# EAGLE design tick-box-1591b-shield-mk-1.0 (EAGLE 6.5.0)
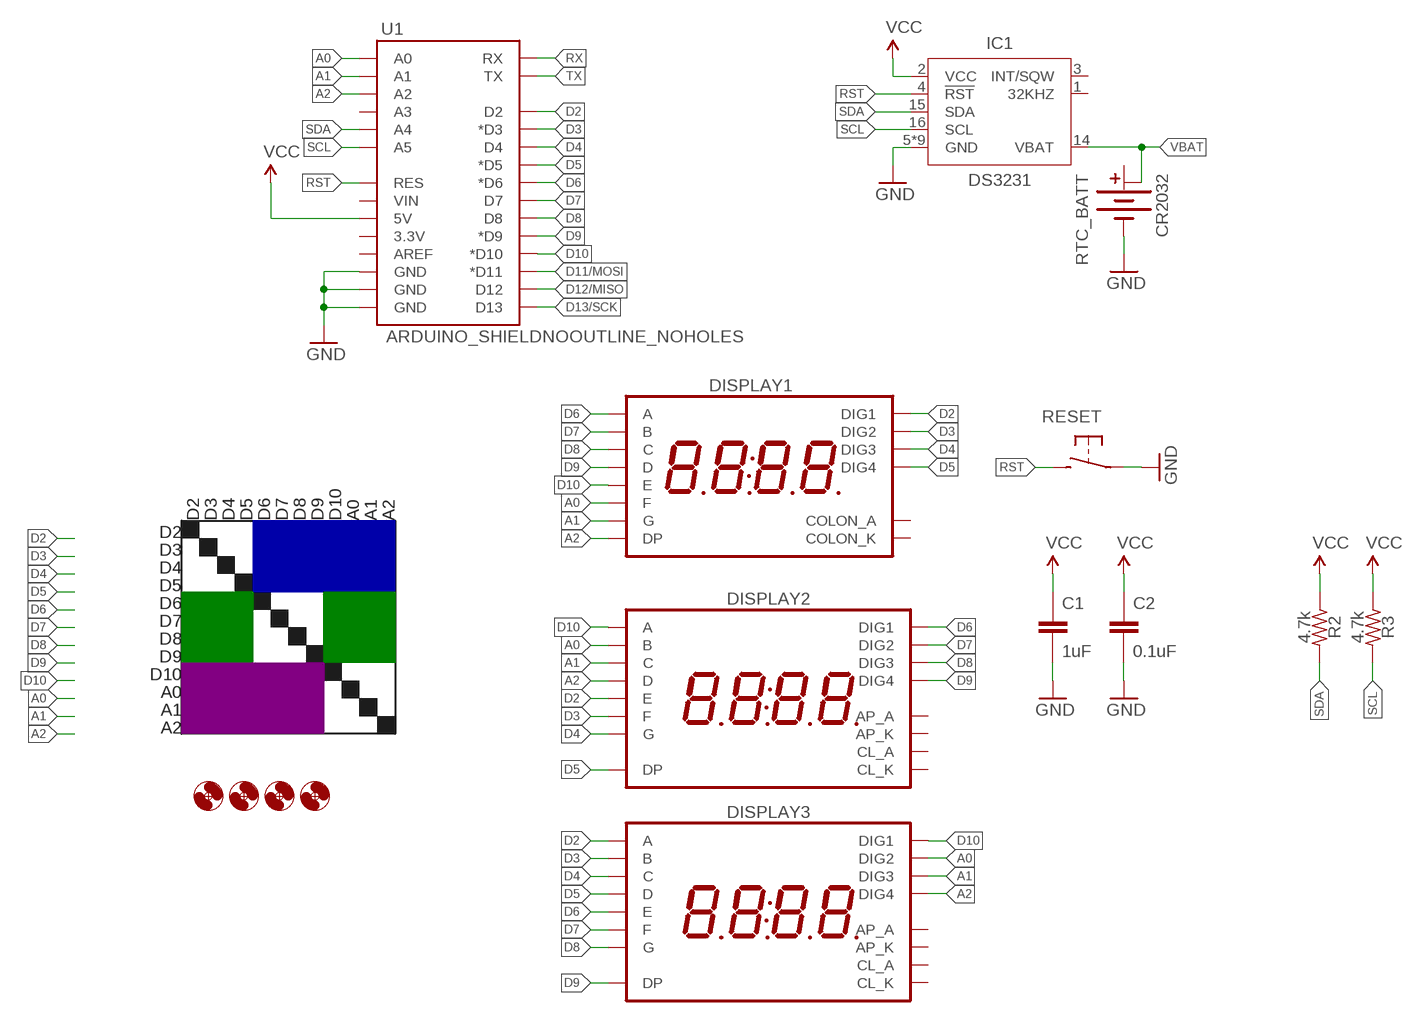
[diagram p0: schematic, sheet 1]

## Parts
C1  1uF  CAPACITOR-CERAMIC025-024X044  [C025-024X044]
C2  0.1uF  CAPACITOR-CERAMIC025-024X044  [C025-024X044]
DISPLAY1  7SEG_4DIGIT_COLON14.2MM-CC-NS  [7SEG_4DIG_NS]
DISPLAY2  7SEG_4DIGIT_COLON_APOS  [7SEG_4DIG_10MM]
DISPLAY3  7SEG_4DIGIT_COLON_APOS  [7SEG_4DIG_10MM]
H1  HOLE#2  [HOLE-#2]
H2  HOLE#2  [HOLE-#2]
H3  HOLE#2  [HOLE-#2]
H4  HOLE#2  [HOLE-#2]
IC1  DS3231  [SO16W]
R2  4.7k  RESISTORPTH-AXIAL-7.62MM  [RESISTOR-AXIAL-PTH-7.62MM]
R3  4.7k  RESISTORPTH-AXIAL-7.62MM  [RESISTOR-AXIAL-PTH-7.62MM]
RESET  SPST-NO-TACT6MM-PTH-SMALL-PADS  [DTS-6-SMALL-PADS]
RTC_BATT  CR2032  BATTERY-COINCR2032_SMD  [BATTCON_20MM_MINE]
U1  ARDUINO_SHIELDNOOUTLINE_NOHOLES  [ARDUINO_SHIELD_NOOUTLINE_NOHOLES]

## Nets
A0: DISPLAY1.P$12(F) DISPLAY2.16(B) DISPLAY3.2(DIG2) U1.A0
A1: DISPLAY1.P$5(G) DISPLAY2.13(C) DISPLAY3.6(DIG3) U1.A1
A2: DISPLAY1.P$3(DP) DISPLAY2.3(D) DISPLAY3.8(DIG4) U1.A2
D2: DISPLAY1.P$14(DIG1) DISPLAY2.5(E) DISPLAY3.14(A) U1.D2
D3: DISPLAY1.P$11(DIG2) DISPLAY2.11(F) DISPLAY3.16(B) U1.D3(*D3)
D4: DISPLAY1.P$10(DIG3) DISPLAY2.15(G) DISPLAY3.13(C) U1.D4
D5: DISPLAY1.P$6(DIG4) DISPLAY2.7(DP) DISPLAY3.3(D) U1.D5(*D5)
D6: DISPLAY1.P$13(A) DISPLAY2.1(DIG1) DISPLAY3.5(E) U1.D6(*D6)
D7: DISPLAY1.P$9(B) DISPLAY2.2(DIG2) DISPLAY3.11(F) U1.D7
D8: DISPLAY1.P$4(C) DISPLAY2.6(DIG3) DISPLAY3.15(G) U1.D8
D9: DISPLAY1.P$2(D) DISPLAY2.8(DIG4) DISPLAY3.7(DP) U1.D9(*D9)
D10: DISPLAY1.P$1(E) DISPLAY2.14(A) DISPLAY3.1(DIG1) U1.D10(*D10)
D11/MOSI: U1.D11(*D11)
D12/MISO: U1.D12
D13/SCK: U1.D13
GND: C1.2 C2.2 IC1.5(GND) IC1.6(GND) IC1.7(GND) IC1.8(GND) IC1.9(GND) IC1.10(GND) IC1.11(GND) IC1.12(GND) IC1.13(GND) RESET.1 RESET.2 RTC_BATT.BOTTOM(-) U1.GND@0(GND) U1.GND@1(GND) U1.GND@2(GND)
RST: IC1.4(!RST) RESET.3 RESET.4 U1.RES
RX: U1.RX
SCL: IC1.16(SCL) R3.P$2 U1.A5
SDA: IC1.15(SDA) R2.P$2 U1.A4
TX: U1.TX
VBAT: IC1.14(VBAT) RTC_BATT.TOP@2(+1)
VCC: C1.1 C2.1 IC1.2(VCC) R2.P$1 R3.P$1 U1.5V
Unconnected: DISPLAY1.P$7(COLON_K) DISPLAY1.P$8(COLON_A) DISPLAY2.4(CL_A) DISPLAY2.9(AP_K) DISPLAY2.10(AP_A) DISPLAY2.12(CL_K) DISPLAY3.4(CL_A) DISPLAY3.9(AP_K) DISPLAY3.10(AP_A) DISPLAY3.12(CL_K) IC1.1(32KHZ) IC1.3(INT/SQW) RTC_BATT.TOP@1(+) U1.3.3V U1.A3 U1.AREF U1.VIN

## Notes on the sheet
- D2 | D3 | D4 | D5 | D6 | D7 | D8 | D9 | D10 | A0 | A1 | A2
- D2
- D3
- D4
- D5
- D6
- D7
- D8
- D9
- D10
- A0
- A1
- A2

## Library data of the parts
C1 C2 = A_butts:CAPACITOR-CERAMIC: CAPACITOR, European symbol
DISPLAY1 = A_butts:7SEG_4DIGIT_COLON
DISPLAY2 DISPLAY3 = A_butts:7SEG_4DIGIT_COLON_APOS
H1-H4 = A_butts:HOLE: MOUNTING HOLE with drill center marker
IC1 = A_butts:DS3231
R2 R3 = A_butts:RESISTOR: RESISTOR, American symbol
RESET = A_butts:SPST-NO-TACT
RTC_BATT = A_butts:BATTERY-COIN
U1 = A_butts:ARDUINO_SHIELD: Arduino shield footprint

## Board
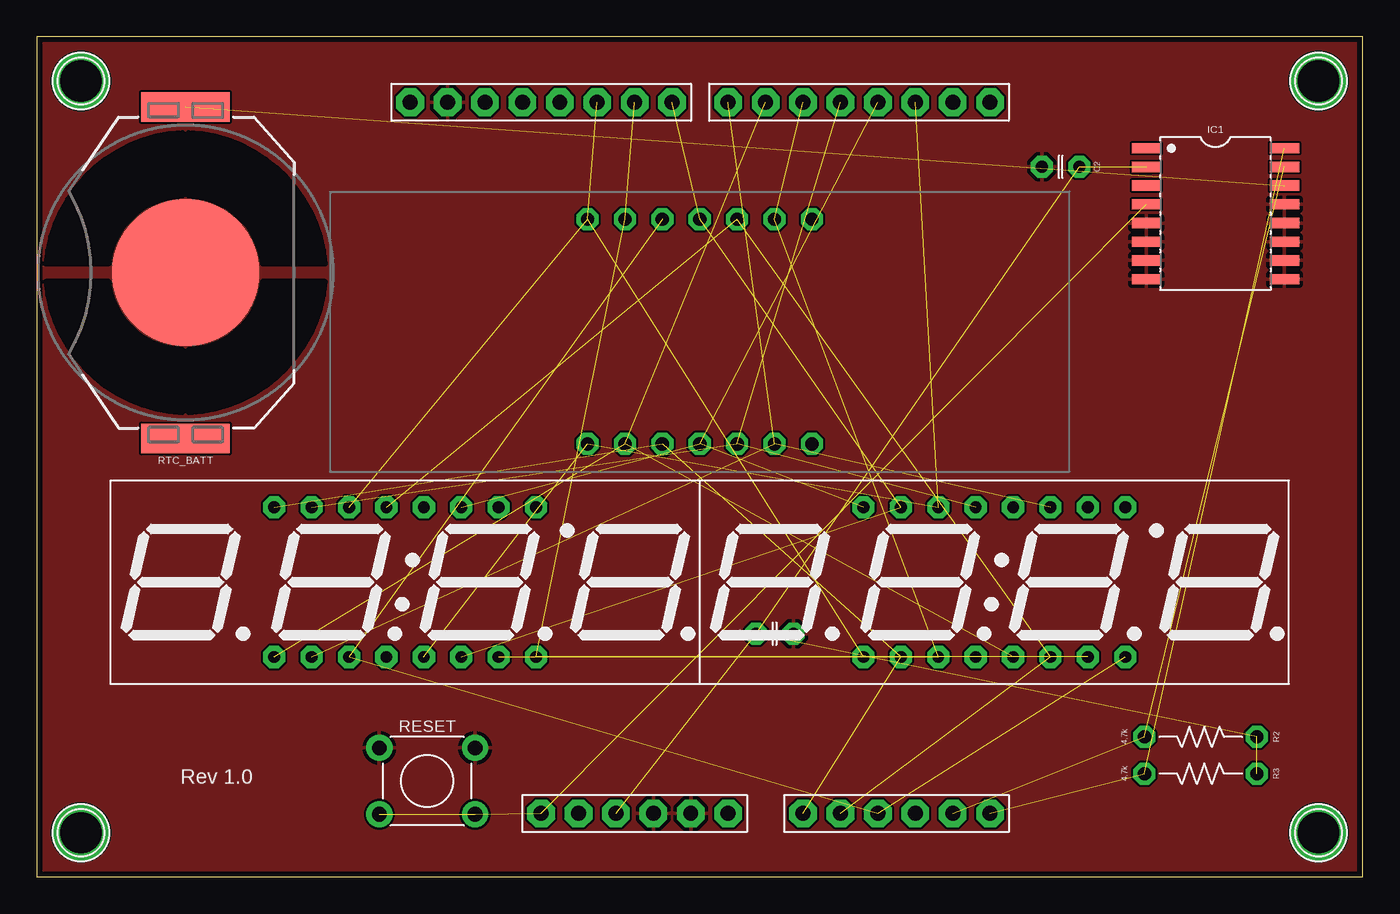
[diagram p1: board, top side]
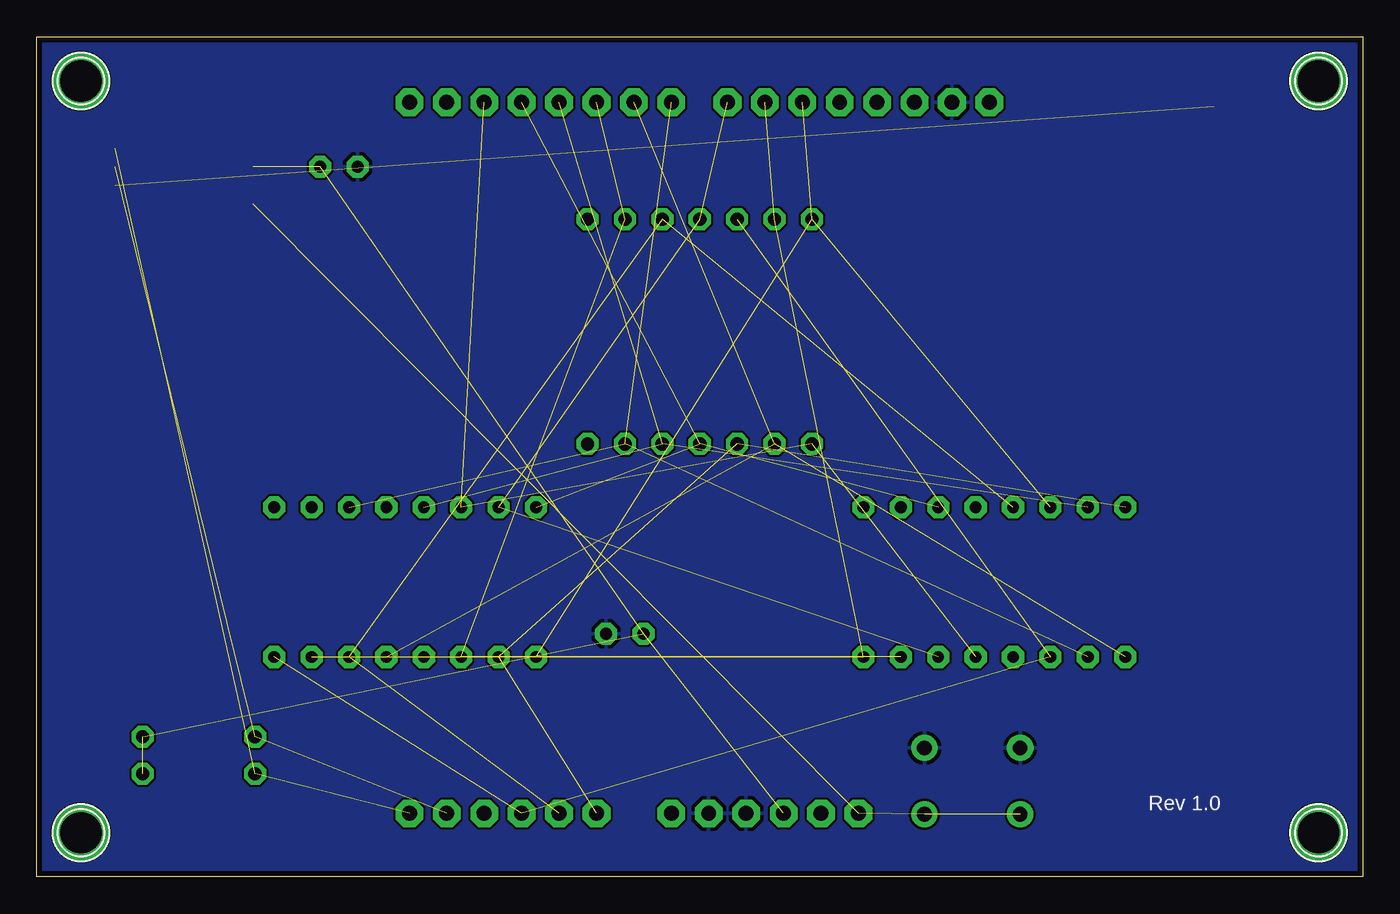
[diagram p2: board, bottom side, seen from below]

Size 90 x 57 mm. Coordinates in mm from the lower left corner, seen from the top.
Outline: 90,57 0,57 0,0 90,0 90,57
Copper layers (1*16): Top 0.0356mm / dielectric 1.5011mm / Bottom 0.0356mm
Design rules "LaenPCBOrder_2": minimum track width 6mil, minimum drill 13mil, track to track 6mil, track to pad 6mil, pad to pad 6mil, via to via 6mil, smd to smd 6mil, copper to edge 15mil, drill to drill 6mil, minimum pad ring 7mil, minimum via ring 7mil, stop-mask expansion 3mil, vias tented up to drill 20mil, thermal gap 10mil

### Footprints (pad centres in the part's own frame; a part is rotated, then mirrored left to right if it is on the bottom)
C025-024X044 = drill 0.813 pad 1.5 octagon: 1 -1.27,0; 2 1.27,0
7SEG_4DIG_NS = drill 0.9 pad 1.5 octagon: P$1 -7.62,7.62; P$2 -5.08,7.62; P$3 -2.54,7.62; P$4 0,7.62; P$5 2.54,7.62; P$6 5.08,7.62; P$7 7.62,7.62; P$8 7.62,-7.62; P$9 5.08,-7.62; P$10 2.54,-7.62; P$11 0,-7.62; P$12 -2.54,-7.62; P$13 -5.08,-7.62; P$14 -7.62,-7.62
7SEG_4DIG_10MM = drill 0.8 pad 1.5 octagon: 1 -8.89,-5.08; 2 -6.35,-5.08; 3 -3.81,-5.08; 4 -1.27,-5.08; 5 1.27,-5.08; 6 3.81,-5.08; 7 6.35,-5.08; 8 8.89,-5.08; 9 8.89,5.08; 10 6.35,5.08; 11 3.81,5.08; 12 1.27,5.08; 13 -1.27,5.08; 14 -3.81,5.08; 15 -6.35,5.08; 16 -8.89,5.08
HOLE-#2 = drill 2.8 pad 3.81: P$1 0,0
SO16W = smd 0.7 x 2: 1 -4.445,-4.685; 2 -3.175,-4.685; 3 -1.905,-4.685; 4 -0.635,-4.685; 5 0.635,-4.685; 6 1.905,-4.685; 7 3.175,-4.685; 8 4.445,-4.685; 9 4.445,4.685; 10 3.175,4.685; 11 1.905,4.685; 12 0.635,4.685; 13 -0.635,4.685; 14 -1.905,4.685; 15 -3.175,4.685; 16 -4.445,4.685
RESISTOR-AXIAL-PTH-7.62MM = drill 0.9 pad 1.5 octagon: P$1 -3.81,0; P$2 3.81,0
DTS-6-SMALL-PADS = drill 1 pad 1.778: 1 -3.25,2.25; 2 3.25,2.25; 3 -3.25,-2.25; 4 3.25,-2.25
BATTCON_20MM_MINE = smd 10 x 10: BOTTOM 0,0 | smd 6 x 2: TOP@1 0,11.25; TOP@2 0,-11.25
ARDUINO_SHIELD_NOOUTLINE_NOHOLES = drill 1.016 pad 1.88 octagon: 3.3V 50.7,12.77; 5V 50.7,15.31; A0 50.7,28.01; A1 50.7,30.55; A2 50.7,33.09; A3 50.7,35.63; A4 50.7,38.17; A5 50.7,40.71; AREF 2.44,1.34; D2 2.44,35.63; D3 2.44,33.09; D4 2.44,30.55; D5 2.44,28.01; D6 2.44,25.47; D7 2.44,22.93; D8 2.44,19.12; D9 2.44,16.58; D10 2.44,14.04; D11 2.44,11.5; D12 2.44,8.96; D13 2.44,6.42; GND@0 50.7,17.85; GND@1 50.7,20.39; GND@2 2.44,3.88; RES 50.7,10.23; RX 2.44,40.71; TX 2.44,38.17; VIN 50.7,22.93

### Placement (x,y rotation side)
C1  50.08,16.5 0 top
C2  69.5,48.17 180 top
DISPLAY1  45,37 0 top
DISPLAY2  25,20 0 top
DISPLAY3  65,20 0 top
H1  3,3 0 top
H2  87,3 0 top
H3  3,54 0 top
H4  87,54 0 top
IC1  80,45 270 top
R2  79,9.5 180 top
R3  79,7 180 top
RESET  26.5,6.5 0 top
RTC_BATT  10.1,41 180 top
U1  24,55 270 top

### Tracks (layer width: path | path; a pad name or v marks a point on that pad's centre or on a via)
A0  (3 unrouted)
A1  (3 unrouted)
A2  (3 unrouted)
D2  (3 unrouted)
D3  (3 unrouted)
D4  (3 unrouted)
D5  (3 unrouted)
D6  (3 unrouted)
D7  (3 unrouted)
D8  (3 unrouted)
D9  (3 unrouted)
D10  (3 unrouted)
GND
  pour Top: 0.1,0 0,0 0,57 90,57 90,0
  pour Bottom: 0.1,0 0,0 0,57 90,57 90,0
RST  (3 unrouted)
SCL  (2 unrouted)
SDA  (2 unrouted)
VBAT  (1 unrouted)
VCC  (5 unrouted)